# EAGLE design M32.v1.0 (EAGLE 6.1)

## Sheet 1 of 3
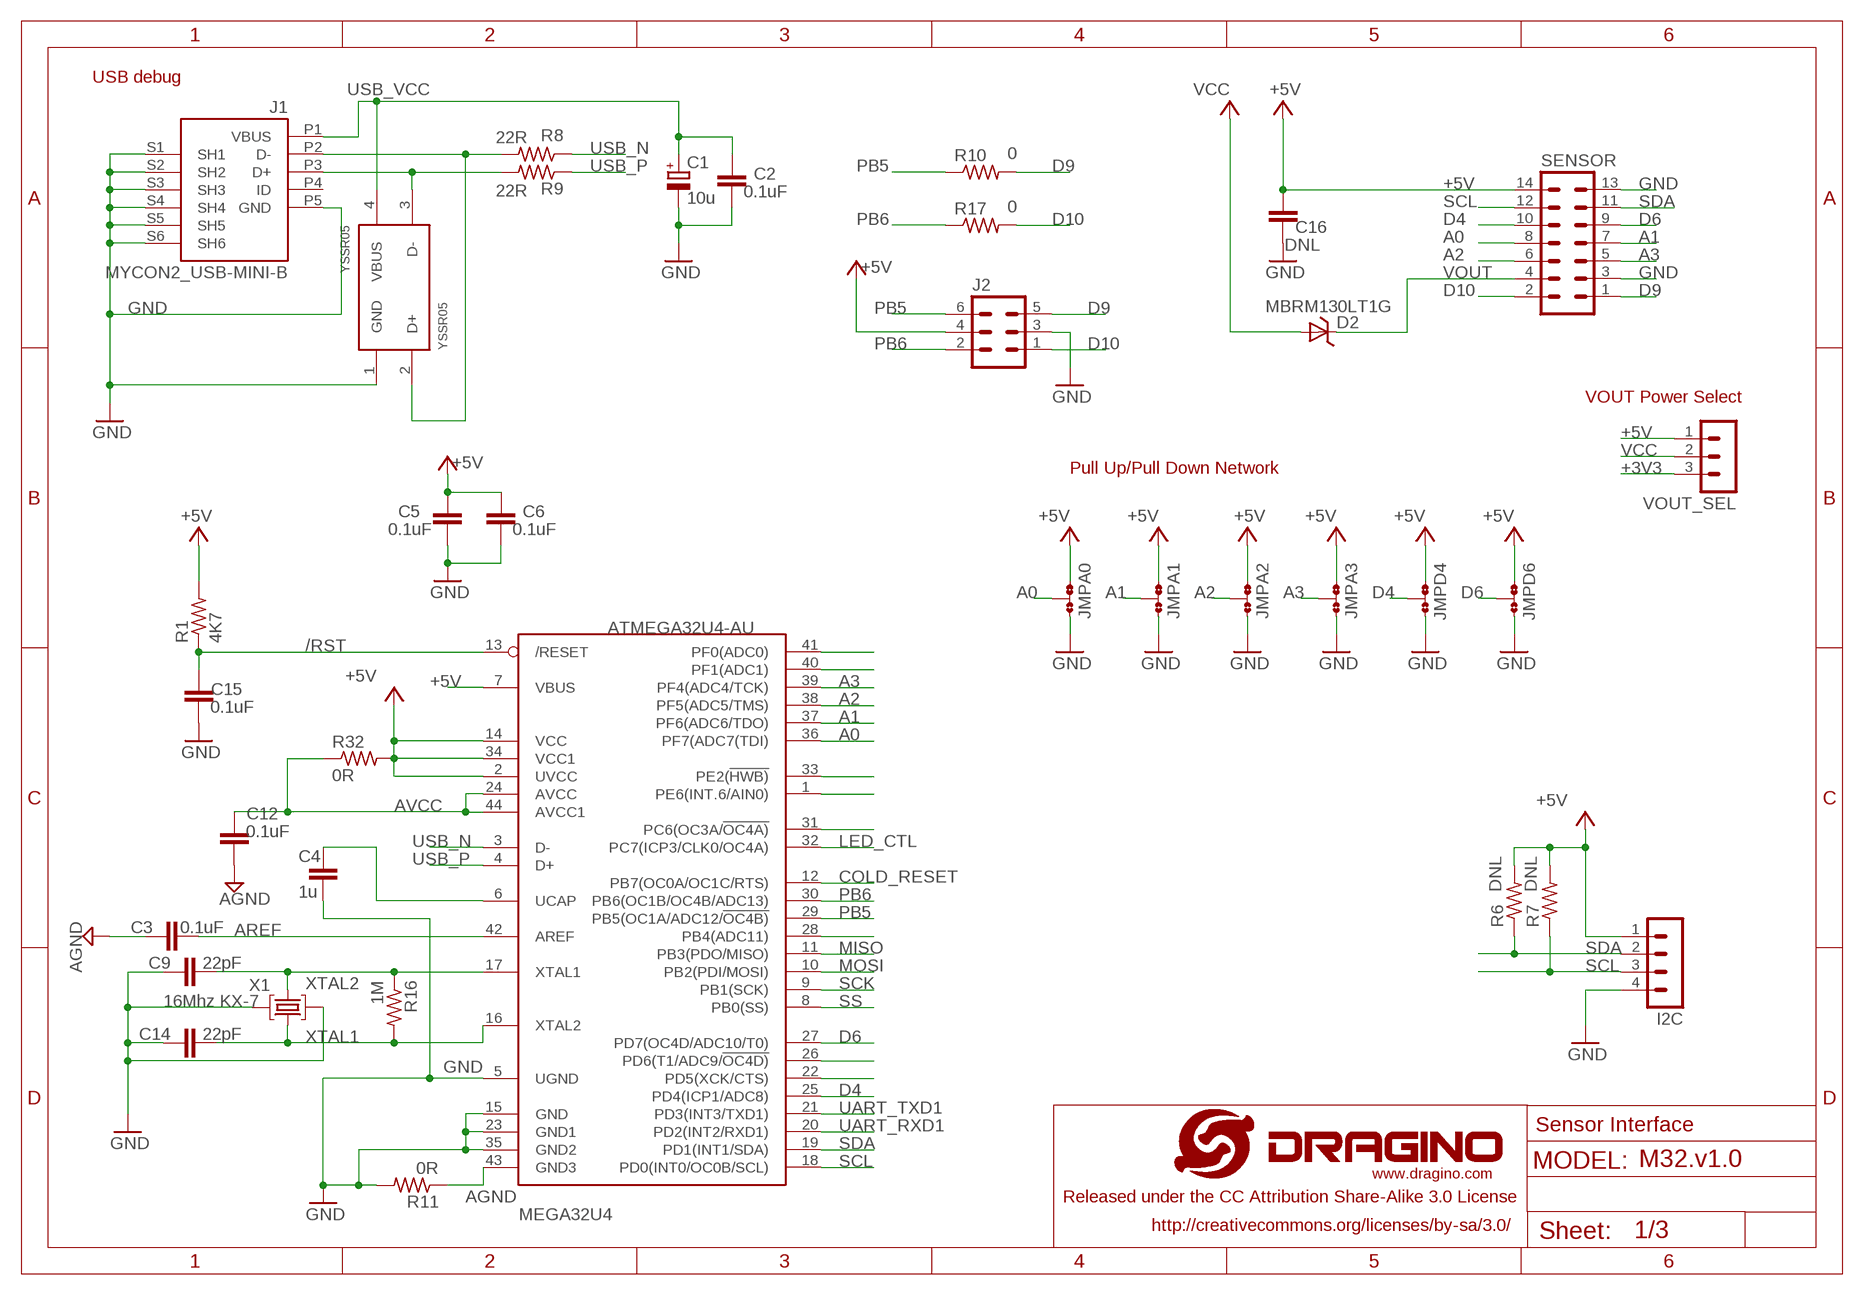
[diagram p0: schematic, sheet 1]

### Parts
C1  10u  CPOL-EUSMCB  [SMC_B]
C2  0.1uF  C-EUC0402  [C0402]
C3  0.1uF  C-EUC0402  [C0402]
C4  1u  C-EUC0402  [C0402]
C5  0.1uF  C-EUC0402  [C0402]
C6  0.1uF  C-EUC0402  [C0402]
C9  22pF  C-EUC0402  [C0402]
C12  0.1uF  C-EUC0402  [C0402]
C14  22pF  C-EUC0402  [C0402]
C15  0.1uF  C-EUC0402  [C0402]
C16  DNL  C-EUC0402  [C0402]
D2  MBRM130LT1G  [POWERMITE]
I2C  MA04-1  [MA04-1]
J1  MYCON2_USB-MINI-B  [CON2_USB_MICRO_B_AT]
J2  MA03-2  [MA03-2]
JMPA0  JUM-A2  0R-JUMPA  [A0R-JMP]
JMPA1  JUM-A2  0R-JUMPA  [A0R-JMP]
JMPA2  JUM-A2  0R-JUMPA  [A0R-JMP]
JMPA3  JUM-A2  0R-JUMPA  [A0R-JMP]
JMPD4  JUM-A2  0R-JUMPA  [A0R-JMP]
JMPD6  JUM-A2  0R-JUMPA  [A0R-JMP]
MEGA32U4  ATMEGA32U4-AU  [TQFP44]
R1  4K7  R-US_R0402  [R0402]
R6  DNL  R-US_R0603  [R0603]
R7  DNL  R-US_R0603  [R0603]
R8  22R  R-US_R0402  [R0402]
R9  22R  R-US_R0402  [R0402]
R10  0  R-US_R0603  [R0603]
R11  0R  R-US_R0603  [R0603]
R16  1M  R-US_R0402  [R0402]
R17  0  R-US_R0603  [R0603]
R32  0R  R-US_R0402  [R0402]
SENSOR  MA07-2  [MA07-2]
VOUT_SEL  MA03-1  [MA03-1]
X1  16Mhz KX-7  CRYSTAL-3.2-2.5  [CRYSTAL-3.2-2.5]
YSSR05  YSSR05  [SOT143]

### Nets
32U4_A4: MEGA32U4.40(PF1(ADC1)) ; also sheet 3
32U4_A5: MEGA32U4.41(PF0(ADC0)) ; also sheet 3
+3V3: VOUT_SEL.3 ; also sheet 2
+5V: C5.1 C6.1 C16.1 I2C.1 J2.4 JMPA0.3 JMPA1.3 JMPA2.3 JMPA3.3 JMPD4.3 JMPD6.3 MEGA32U4.2(UVCC) MEGA32U4.7(VBUS) MEGA32U4.14(VCC) MEGA32U4.34(VCC1) R1.2 R6.2 R7.2 R32.2 SENSOR.14 VOUT_SEL.1 ; also sheet 2,3
/RST: C15.1 MEGA32U4.13(/RESET) R1.1 ; also sheet 2,3
A0: JMPA0.2 MEGA32U4.36(PF7(ADC7(TDI)) SENSOR.8 ; also sheet 3
A1: JMPA1.2 MEGA32U4.37(PF6(ADC6/TDO)) SENSOR.7 ; also sheet 3
A2: JMPA2.2 MEGA32U4.38(PF5(ADC5/TMS)) SENSOR.6 ; also sheet 3
A3: JMPA3.2 MEGA32U4.39(PF4(ADC4/TCK)) SENSOR.5 ; also sheet 3
AGND: C3.1 MEGA32U4.43(GND3) R11.1 ; also sheet 3
AREF: C3.2 MEGA32U4.42(AREF) ; also sheet 3
AVCC: C12.1 MEGA32U4.24(AVCC) MEGA32U4.44(AVCC1) R32.1 ; also sheet 3
COLD_RESET: MEGA32U4.12(PB7(OC0A/OC1C/RTS)) ; also sheet 2,3
D4: JMPD4.2 MEGA32U4.25(PD4(ICP1/ADC8)) SENSOR.10 ; also sheet 3
D6: JMPD6.2 MEGA32U4.27(PD7(OC4D/ADC10/T0)) SENSOR.9 ; also sheet 3
D9: J2.5 R10.2 SENSOR.1
D10: J2.1 R17.2 SENSOR.2
GND [gnd]: C1.- C2.2 C4.1 C5.2 C6.2 C9.1 C14.1 C15.2 C16.2 I2C.4 J1.P5(GND) J1.S1(SH1) J1.S2(SH2) J1.S3(SH3) J1.S4(SH4) J1.S5(SH5) J1.S6(SH6) J2.3 JMPA0.1 JMPA1.1 JMPA2.1 JMPA3.1 JMPD4.1 JMPD6.1 MEGA32U4.5(UGND) MEGA32U4.15(GND) MEGA32U4.23(GND1) MEGA32U4.35(GND2) R11.2 SENSOR.3 SENSOR.13 X1.2(GND) X1.4(GND) YSSR05.1(GND) ; also sheet 2,3
GND1: C12.2 ; supply symbol labelled AGND
LED_CTL: MEGA32U4.32(PC7(ICP3/CLK0/OC4A)) ; also sheet 2,3
MISO: MEGA32U4.11(PB3(PDO/MISO)) ; also sheet 2,3
MOSI: MEGA32U4.10(PB2(PDI/MOSI)) ; also sheet 2,3
N$2: J1.P2(D-) R8.2 YSSR05.2(D+)
N$4: C4.2 MEGA32U4.6(UCAP) ; also sheet 3
N$10: J1.P3(D+) R9.2 YSSR05.3(D-)
PB4: MEGA32U4.28(PB4(ADC11)) ; also sheet 3
PB5: J2.6 MEGA32U4.29(PB5(OC1A/ADC12/!OC4B)) R10.1 ; also sheet 3
PB6: J2.2 MEGA32U4.30(PB6(OC1B/OC4B/ADC13)) R17.1 ; also sheet 3
PC6: MEGA32U4.31(PC6(OC3A/!OC4A)) ; also sheet 3
PD5: MEGA32U4.22(PD5(XCK/CTS)) ; also sheet 3
PD6: MEGA32U4.26(PD6(T1/ADC9/!OC4D)) ; also sheet 3
PE2: MEGA32U4.33(PE2(!HWB)) ; also sheet 3
PE6: MEGA32U4.1(PE6(INT.6/AIN0)) ; also sheet 3
SCK: MEGA32U4.9(PB1(SCK)) ; also sheet 2,3
SCL: I2C.3 MEGA32U4.18(PD0(INT0/OC0B/SCL)) R7.1 SENSOR.12 ; also sheet 3
SDA: I2C.2 MEGA32U4.19(PD1(INT1/SDA)) R6.1 SENSOR.11 ; also sheet 3
SS: MEGA32U4.8(PB0(SS)) ; also sheet 2,3
UART_RXD1: MEGA32U4.20(PD2(INT2/RXD1)) ; also sheet 2,3
UART_TXD1: MEGA32U4.21(PD3(INT3/TXD1)) ; also sheet 2,3
USB_N: MEGA32U4.3(D-) R8.1 ; also sheet 3
USB_P: MEGA32U4.4(D+) R9.1 ; also sheet 3
USB_VCC: C1.+ C2.1 J1.P1(VBUS) YSSR05.4(VBUS)
VCC: D2.2(A) VOUT_SEL.2
VOUT: D2.1(C) SENSOR.4
XTAL1: C14.2 MEGA32U4.16(XTAL2) R16.2 X1.3(C2) ; also sheet 3
XTAL2: C9.2 MEGA32U4.17(XTAL1) R16.1 X1.1(C1) ; also sheet 3
Unconnected: J1.P4(ID)

### Notes on the sheet
- USB debug
- VOUT Power Select
- Pull Up/Pull Down Network
- Sensor Interface

## Sheet 2 of 3
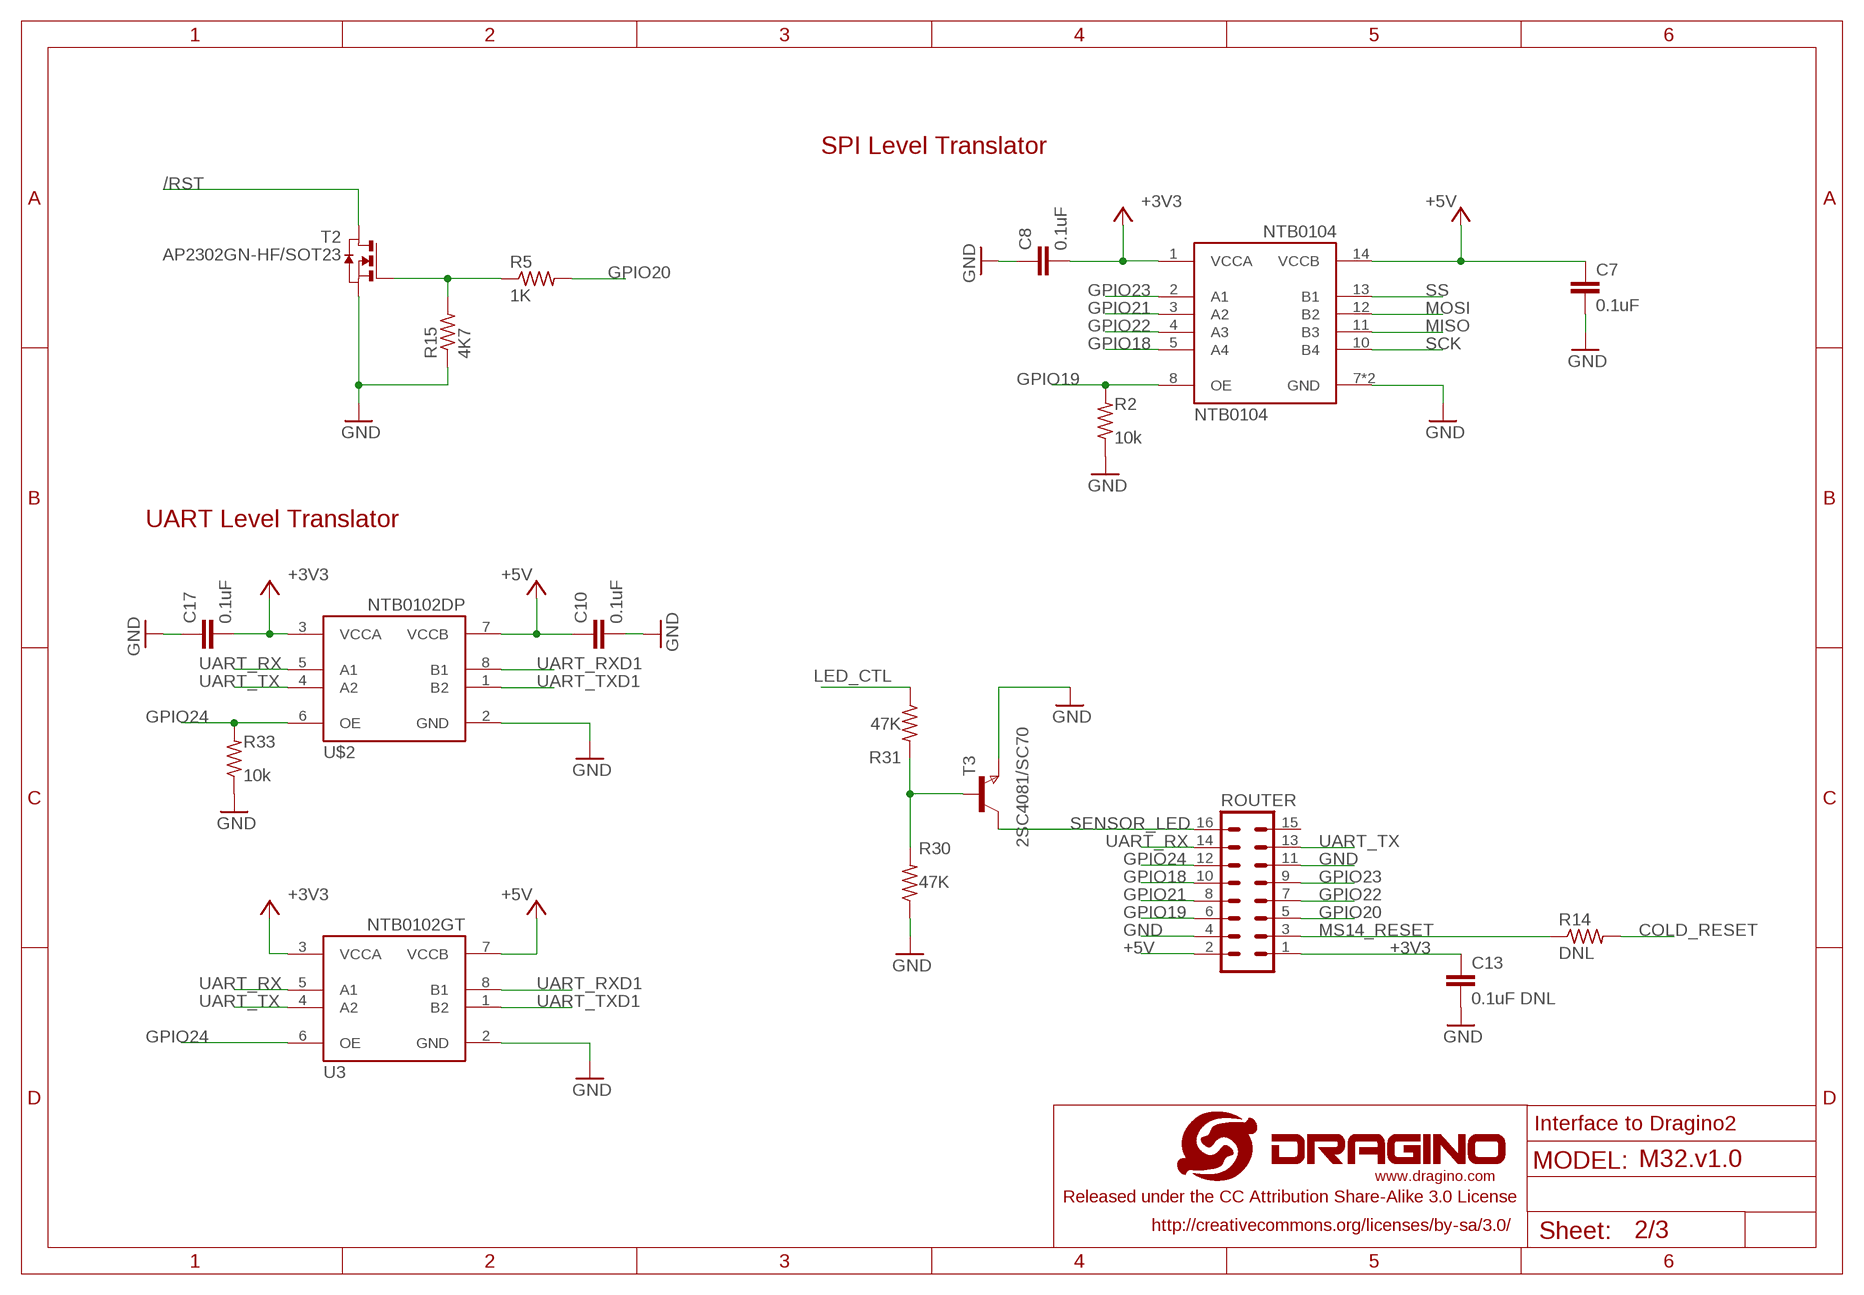
[diagram p1: schematic, sheet 2]

### Parts
C7  0.1uF  C-EUC0402  [C0402]
C8  0.1uF  C-EUC0402  [C0402]
C10  0.1uF  C-EUC0402  [C0402]
C13  0.1uF DNL  C-EUC0402  [C0402]
C17  0.1uF  C-EUC0402  [C0402]
NTB0104  NTB0104  [DHVQFN14]
R2  10k  R-US_R0402  [R0402]
R5  1K  R-US_R0402  [R0402]
R14  DNL  R-US_R0402  [R0402]
R15  4K7  R-US_R0402  [R0402]
R30  47K  R-US_R0402  [R0402]
R31  47K  R-US_R0402  [R0402]
R33  10k  R-US_R0402  [R0402]
ROUTER  MA08-2  [MA08-2]
T2  AP2302GN-HF/SOT23  NMOSFET-SOT23  [SOT-23]
T3  2SC4081/SC70  NPNSOT323  [SOT323]
U3  NTB0102GT  [NXP-SOT833-1]
U$2  NTB0102DP  [NTB0102-SOT505-2]
U$5  LOGO-NEW  [LOGO-SILK-NEW]

### Nets
+3V3: C8.2 C13.1 C17.2 NTB0104.1(VCCA) ROUTER.1 U3.3(VCCA) U$2.3(VCCA) ; also sheet 1
+5V: C7.1 C10.1 NTB0104.14(VCCB) ROUTER.2 U3.7(VCCB) U$2.7(VCCB) ; also sheet 1,3
/RST: T2.1(D) ; also sheet 1,3
COLD_RESET: R14.2 ; also sheet 1,3
GND [gnd]: C7.2 C8.1 C10.2 C13.2 C17.1 NTB0104.7(GND) NTB0104.EXP(GND) R2.1 R15.1 R30.1 R33.1 ROUTER.4 ROUTER.11 T2.2(S) T3.3(E) U3.2(GND) U$2.2(GND) ; also sheet 1,3
GPIO18: NTB0104.5(A4) ROUTER.10
GPIO19: NTB0104.8(OE) R2.2 ROUTER.6
GPIO20: R5.2 ROUTER.5
GPIO21: NTB0104.3(A2) ROUTER.8
GPIO22: NTB0104.4(A3) ROUTER.7
GPIO23: NTB0104.2(A1) ROUTER.9
GPIO24: R33.2 ROUTER.12 U3.6(OE) U$2.6(OE)
LED_CTL: R31.1 ; also sheet 1,3
MISO: NTB0104.11(B3) ; also sheet 1,3
MOSI: NTB0104.12(B2) ; also sheet 1,3
MS14_RESET: R14.1 ROUTER.3
N$8: R5.1 R15.2 T2.3(G)
N$9: R30.2 R31.2 T3.2(B)
SCK: NTB0104.10(B4) ; also sheet 1,3
SENSOR_LED: ROUTER.16 T3.1(C)
SS: NTB0104.13(B1) ; also sheet 1,3
UART_RX: ROUTER.14 U3.5(A1) U$2.5(A1)
UART_RXD1: U3.8(B1) U$2.8(B1) ; also sheet 1,3
UART_TX: ROUTER.13 U3.4(A2) U$2.4(A2)
UART_TXD1: U3.1(B2) U$2.1(B2) ; also sheet 1,3
Unconnected: ROUTER.15

### Notes on the sheet
- SPI Level Translator
- UART Level Translator
- Interface to Dragino2

## Sheet 3 of 3
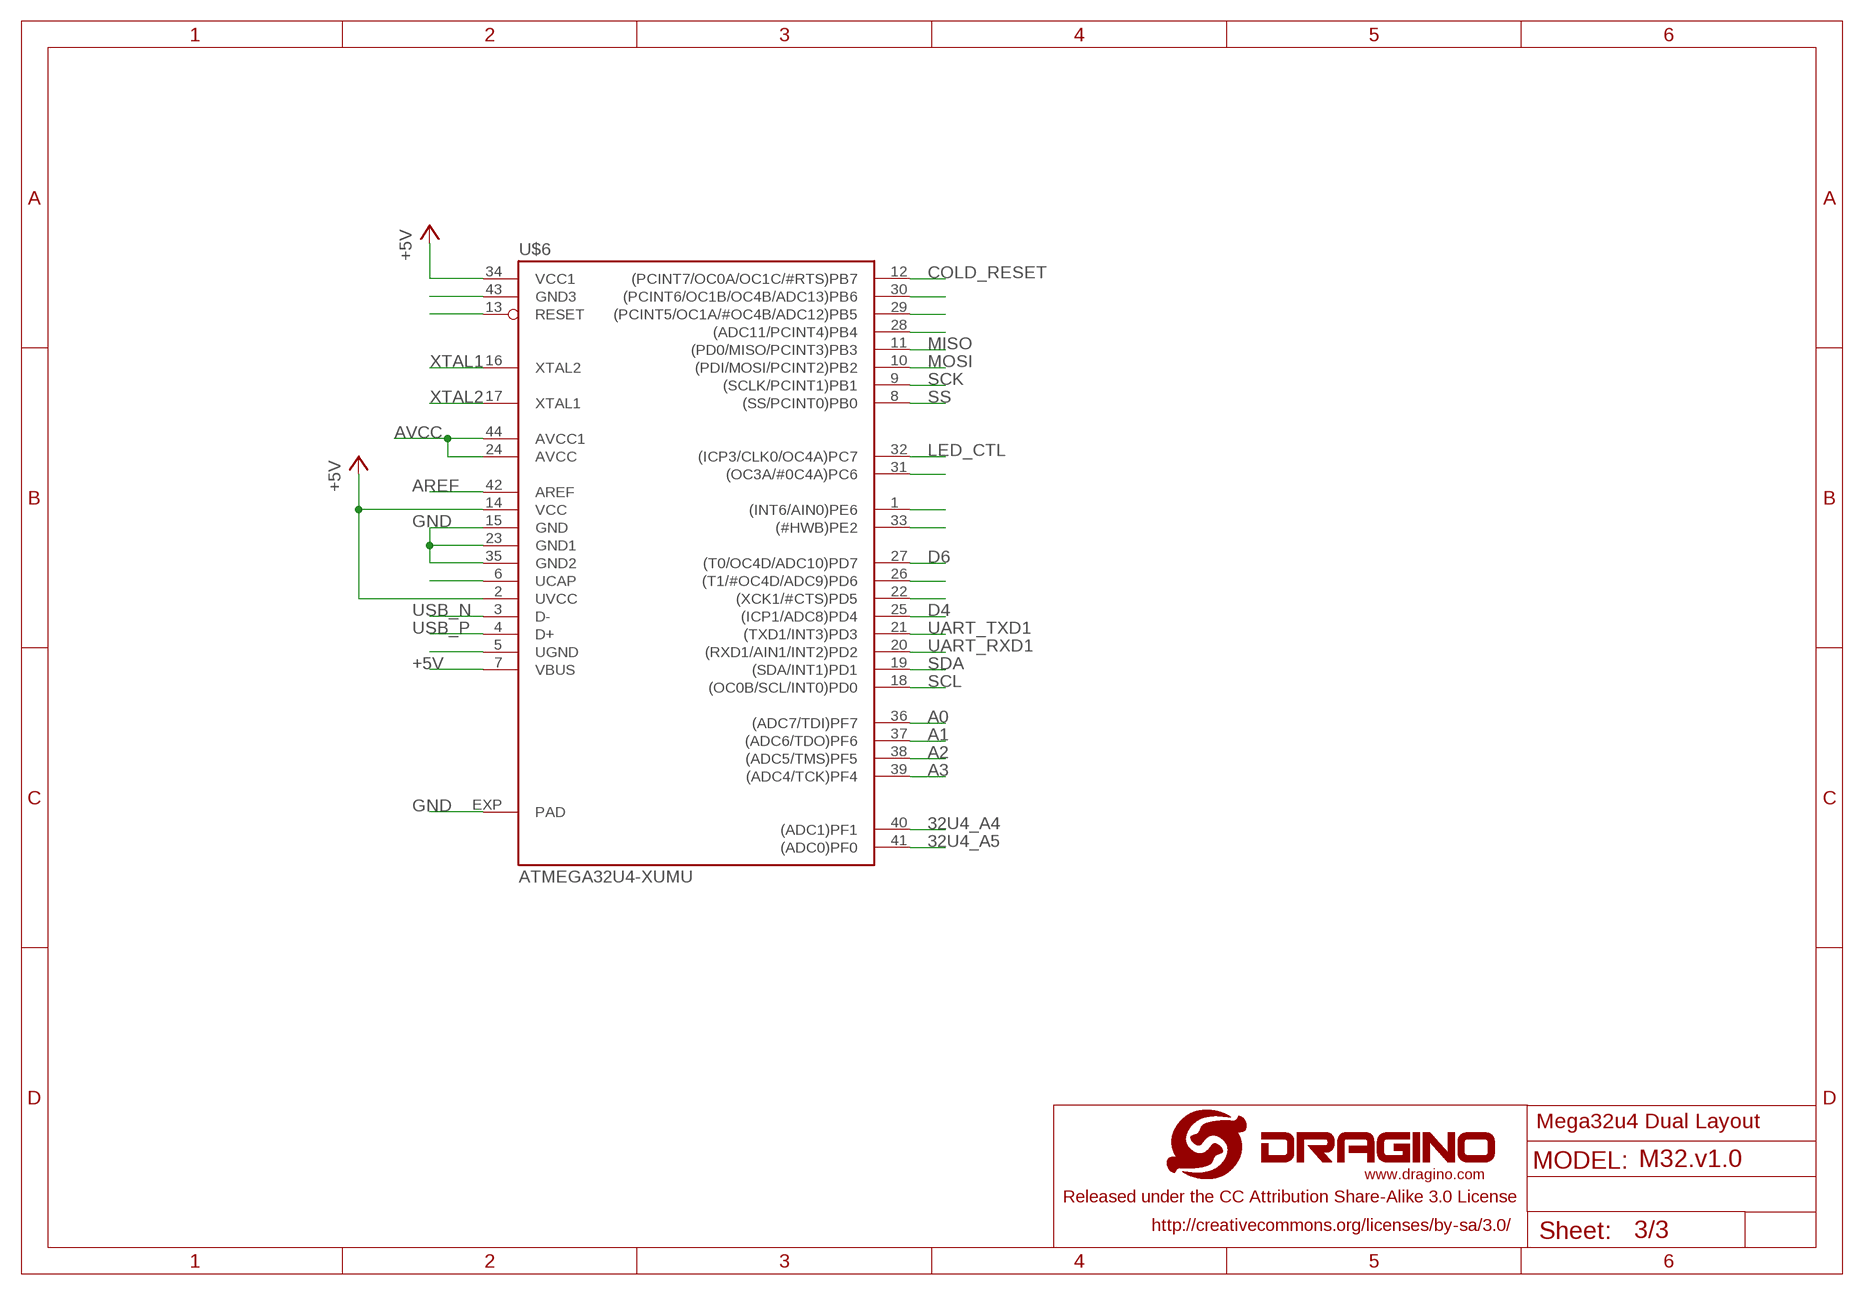
[diagram p2: schematic, sheet 3]

### Parts
U$6  ATMEGA32U4-XUMU  [QFN44ML7X7]

### Nets
32U4_A4: U$6.40((ADC1)PF1) ; also sheet 1
32U4_A5: U$6.41((ADC0)PF0) ; also sheet 1
+5V: U$6.2(UVCC) U$6.7(VBUS) U$6.14(VCC) U$6.34(VCC1) ; also sheet 1,2
/RST: U$6.13(RESET) ; also sheet 1,2
A0: U$6.36((ADC7/TDI)PF7) ; also sheet 1
A1: U$6.37((ADC6/TDO)PF6) ; also sheet 1
A2: U$6.38((ADC5/TMS)PF5) ; also sheet 1
A3: U$6.39((ADC4/TCK)PF4) ; also sheet 1
AGND: U$6.43(GND3) ; also sheet 1
AREF: U$6.42(AREF) ; also sheet 1
AVCC: U$6.24(AVCC) U$6.44(AVCC1) ; also sheet 1
COLD_RESET: U$6.12((PCINT7/OC0A/OC1C/#RTS)PB7) ; also sheet 1,2
D4: U$6.25((ICP1/ADC8)PD4) ; also sheet 1
D6: U$6.27((T0/OC4D/ADC10)PD7) ; also sheet 1
GND [gnd]: U$6.5(UGND) U$6.15(GND) U$6.23(GND1) U$6.35(GND2) U$6.EXP(PAD) ; also sheet 1,2
LED_CTL: U$6.32((ICP3/CLK0/OC4A)PC7) ; also sheet 1,2
MISO: U$6.11((PD0/MISO/PCINT3)PB3) ; also sheet 1,2
MOSI: U$6.10((PDI/MOSI/PCINT2)PB2) ; also sheet 1,2
N$4: U$6.6(UCAP) ; also sheet 1
PB4: U$6.28((ADC11/PCINT4)PB4) ; also sheet 1
PB5: U$6.29((PCINT5/OC1A/#OC4B/ADC12)PB5) ; also sheet 1
PB6: U$6.30((PCINT6/OC1B/OC4B/ADC13)PB6) ; also sheet 1
PC6: U$6.31((OC3A/#0C4A)PC6) ; also sheet 1
PD5: U$6.22((XCK1/#CTS)PD5) ; also sheet 1
PD6: U$6.26((T1/#OC4D/ADC9)PD6) ; also sheet 1
PE2: U$6.33((#HWB)PE2) ; also sheet 1
PE6: U$6.1((INT6/AIN0)PE6) ; also sheet 1
SCK: U$6.9((SCLK/PCINT1)PB1) ; also sheet 1,2
SCL: U$6.18((OC0B/SCL/INT0)PD0) ; also sheet 1
SDA: U$6.19((SDA/INT1)PD1) ; also sheet 1
SS: U$6.8((SS/PCINT0)PB0) ; also sheet 1,2
UART_RXD1: U$6.20((RXD1/AIN1/INT2)PD2) ; also sheet 1,2
UART_TXD1: U$6.21((TXD1/INT3)PD3) ; also sheet 1,2
USB_N: U$6.3(D-) ; also sheet 1
USB_P: U$6.4(D+) ; also sheet 1
XTAL1: U$6.16(XTAL2) ; also sheet 1
XTAL2: U$6.17(XTAL1) ; also sheet 1

### Notes on the sheet
- Mega32u4 Dual Layout

## Library data of the parts
C1 = rcl:CPOL-EU: POLARIZED CAPACITOR, European symbol
C2-C10 C12-C17 = SmartPrj:C-EU: CAPACITOR, European symbol
D2 = dragino:MBRM130LT1G: Schottky Power Rectifier http://www.onsemi.cn/pub_link/Collateral/MBRM130L-D.PDF
I2C = con-lstb:MA04-1: PIN HEADER; OC_FARNELL: unknown; OC_NEWARK: unknown
J1 = SmartPrj:MYCON2_USB-MINI-B
J2 = con-lstb:MA03-2: PIN HEADER; OC_FARNELL: unknown; OC_NEWARK: unknown
JMPA0 JMPA1-JMPA3 JMPD4 JMPD6 = jump-0r-smd:0R-JUMP: SMD 0R 0805 Jumper
MEGA32U4 = adafruit:ATMEGA32U4: http://www.ladyada.net/library/eagle
NTB0104 = dragino:NTB0104
R1 R2 R5 R8 R9 R11 R14-R16 R30 R31 R33 = dragino:R-US_: RESISTOR, American symbol
R6 R7 R10 R17 R32 = rcl:R-US_: RESISTOR, American symbol
ROUTER = dragino:MA08-2: PIN HEADER; OC_FARNELL: unknown; OC_NEWARK: unknown
SENSOR = dragino:MA07-2: PIN HEADER; OC_FARNELL: unknown; OC_NEWARK: unknown
T2 = dragino:NMOSFET-SOT23: MOS FET; OC_FARNELL: unknown; OC_NEWARK: unknown
T3 = zetex:NPNSOT323: NPN TRANSISTOR; MPN: DSS4160U-7; OC_FARNELL: 1710696; OC_NEWARK: 25R4558
U3 U$2 = dragino:NTB0102
U$5 = dragino:LOGO-NEW
U$6 = dragino:ATMEGA32U4-XU
VOUT_SEL = con-lstb:MA03-1: PIN HEADER; OC_FARNELL: unknown; OC_NEWARK: unknown
X1 = SmartPrj:CRYSTAL-3.2-2.5
YSSR05 = dragino:YSSR05: Yeashin LOW CAPACITANCE TVS DIODE ARRAY http://www.yeashin.tw/download.php?id=4588

## Net classes
0 default: width 0.203 mm, clearance 0.254 mm
1 power: width 0.61 mm, drill 0.61 mm, clearance 0.254 mm
2 gnd: width 0.305 mm, drill 0.33 mm, clearance 0.254 mm
3 usbvcc: width 0.508 mm, drill 0.61 mm, clearance 0.254 mm
4 aref: width 0.406 mm, drill 0.61 mm, clearance 0.254 mm

## Board
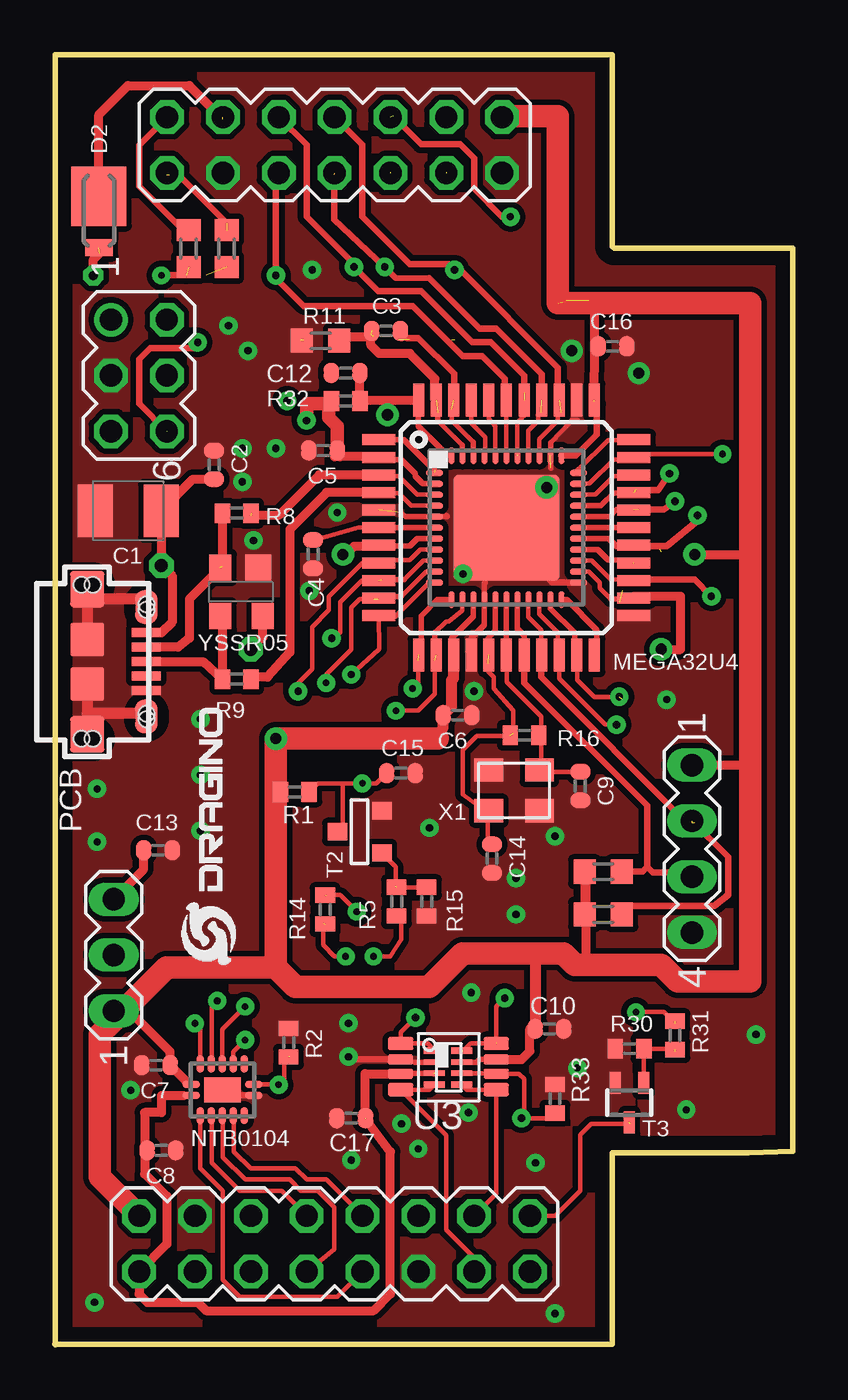
[diagram p3: board, top side]
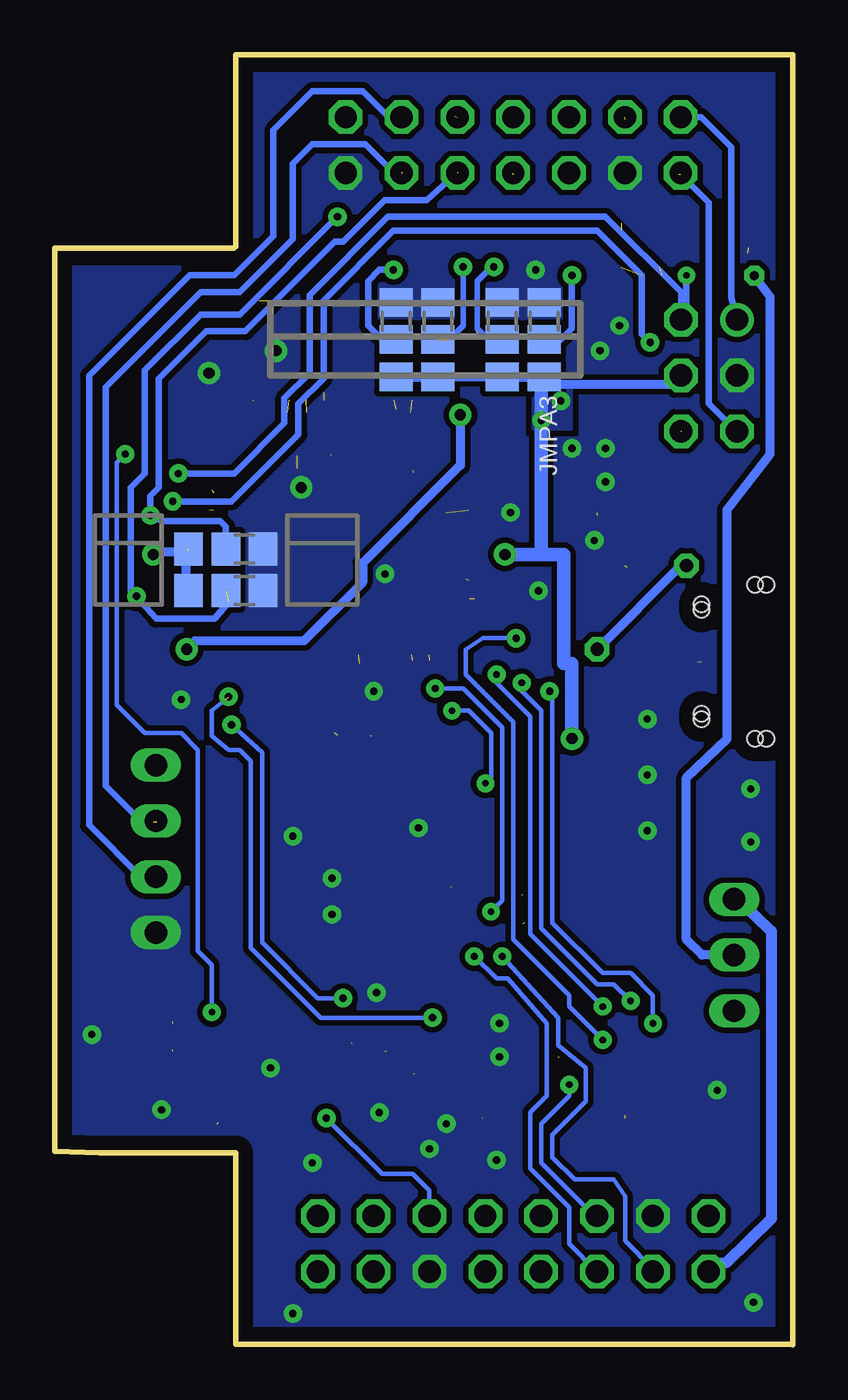
[diagram p4: board, bottom side, seen from below]

Size 33.57 x 58.69 mm. Coordinates in mm from the lower left corner, seen from the top.
Outline: 25.35,49.96 25.35,58.69 0.02,58.69 0.02,0
Outline: 25.45,49.9 33.57,49.9 33.57,8.8 31.53,8.73 25.35,8.73 25.35,0.02 0,0.02
Copper layers (1*16): Top 0.035mm / dielectric 1.5mm / Bottom 0.035mm
Design rules: minimum track width 5mil, minimum drill 10mil, track to track 6mil, track to pad 7mil, pad to pad 7mil, via to via 10mil, smd to smd 7mil, copper to edge 26mil, drill to drill 10mil, minimum pad ring 10mil, minimum via ring 10mil, stop-mask expansion 1mil, vias tented up to drill 30mil, thermal gap 10mil

### Footprints (pad centres in the part's own frame; a part is rotated, then mirrored left to right if it is on the bottom)
SMC_B = smd 1.6 x 2.4: + -1.5,0; - 1.5,0
C0402 = smd 0.7 x 0.9: 1 -0.65,0; 2 0.65,0
POWERMITE = smd 2.7 x 2.5: 1 -0.635,0 | smd 0.76 x 1.27: 2 1.695,0
MA04-1 = drill 1.016 long: 1 -3.81,0; 2 -1.27,0; 3 1.27,0; 4 3.81,0
CON2_USB_MICRO_B_AT = smd 0.406 x 1.346: P1 -1.321,2.692; P2 -0.66,2.692; P3 0,2.692; P4 0.66,2.692; P5 1.321,2.692 | smd 1.651 x 1.549: S1 -3.302,0; S2 3.302,0 | smd 1.524 x 1.016: S3 -2.489,2.692; S4 2.489,2.692 | smd 1.524 x 1.524: S5 -1.016,0; S6 1.016,0 | hole 0.7: -3.505,0.254; -3.505,-0.254; 3.505,0.254; 3.505,-0.254; -2.616,2.692; -2.362,2.692; 2.362,2.692; 2.616,2.692
MA03-2 = drill 1.016: 1 -2.54,-1.27 | drill 1.016 octagon: 2 -2.54,1.27; 3 0,-1.27; 4 0,1.27; 5 2.54,-1.27; 6 2.54,1.27
A0R-JMP = smd 1.5 x 1.3: 1 0,1.7; 2 0,0; 3 0,-1.7
TQFP44 = smd 1.5 x 0.5: 1 -5.8,4; 2 -5.8,3.2; 3 -5.8,2.4; 4 -5.8,1.6; 5 -5.8,0.8; 6 -5.8,0; 7 -5.8,-0.8; 8 -5.8,-1.6; 9 -5.8,-2.4; 10 -5.8,-3.2; 11 -5.8,-4; 23 5.8,-4; 24 5.8,-3.2; 25 5.8,-2.4; 26 5.8,-1.6; 27 5.8,-0.8; 28 5.8,0; 29 5.8,0.8; 30 5.8,1.6; 31 5.8,2.4; 32 5.8,3.2; 33 5.8,4 | smd 0.5 x 1.5: 12 -4,-5.8; 13 -3.2,-5.8; 14 -2.4,-5.8; 15 -1.6,-5.8; 16 -0.8,-5.8; 17 0,-5.8; 18 0.8,-5.8; 19 1.6,-5.8; 20 2.4,-5.8; 21 3.2,-5.8; 22 4,-5.8; 34 4,5.8; 35 3.2,5.8; 36 2.4,5.8; 37 1.6,5.8; 38 0.8,5.8; 39 0,5.8; 40 -0.8,5.8; 41 -1.6,5.8; 42 -2.4,5.8; 43 -3.2,5.8; 44 -4,5.8
DHVQFN14 = smd 0.8 x 0.35: 1 -1.425,-0.25; 7 1.425,-0.25; 8 1.425,0.25; 14 -1.425,0.25 | smd 0.35 x 0.8: 2 -1,-1.175; 3 -0.5,-1.175; 4 0,-1.175; 5 0.5,-1.175; 6 1,-1.175; 9 1,1.175; 10 0.5,1.175; 11 0,1.175; 12 -0.5,1.175; 13 -1,1.175 | smd 1.65 x 1.15: EXP 0,0
R0402 = smd 0.7 x 0.9: 1 -0.65,0; 2 0.65,0
R0603 = smd 1 x 1.1: 1 -0.85,0; 2 0.85,0
MA08-2 = drill 1.016 octagon: 1 -8.89,-1.27; 2 -8.89,1.27; 3 -6.35,-1.27; 4 -6.35,1.27; 5 -3.81,-1.27; 6 -3.81,1.27; 7 -1.27,-1.27; 8 -1.27,1.27; 9 1.27,-1.27; 10 1.27,1.27; 11 3.81,-1.27; 12 3.81,1.27; 13 6.35,-1.27; 14 6.35,1.27; 15 8.89,-1.27; 16 8.89,1.27
MA07-2 = drill 1.016 octagon: 1 -7.62,-1.27; 2 -7.62,1.27; 3 -5.08,-1.27; 4 -5.08,1.27; 5 -2.54,-1.27; 6 -2.54,1.27; 7 0,-1.27; 8 0,1.27; 9 2.54,-1.27; 10 2.54,1.27; 11 5.08,-1.27; 12 5.08,1.27; 13 7.62,-1.27; 14 7.62,1.27
SOT-23 = smd 0.787 x 0.889: 1 0.025,-1.016; 2 -0.94,1.016; 3 0.991,1.016
SOT323 = smd 0.5 x 1: 1 0,0.9; 2 -0.65,-0.9; 3 0.65,-0.9
NXP-SOT833-1 = smd 1 x 0.3: 1 -0.614,0.778 | smd 0.95 x 0.25: 2 -0.639,0.253; 3 -0.639,-0.247; 6 0.611,-0.247; 7 0.611,0.253 | smd 0.95 x 0.3: 4 -0.639,-0.772; 5 0.611,-0.772; 8 0.611,0.778
NTB0102-SOT505-2 = smd 1.15 x 0.6: 1 -2.318,1.084; 4 -2.318,-1.016; 5 2.032,-1.016; 8 2.032,1.084 | smd 1.15 x 0.45: 2 -2.318,0.359; 3 -2.318,-0.291; 6 2.032,-0.291; 7 2.032,0.359
QFN44ML7X7 = smd 0.75 x 0.275: 1 -3.275,2.5; 2 -3.275,2; 3 -3.275,1.5; 4 -3.275,1; 5 -3.275,0.5; 6 -3.275,0; 7 -3.275,-0.5; 8 -3.275,-1; 9 -3.275,-1.5; 10 -3.275,-2; 11 -3.275,-2.5; 23 3.275,-2.5; 24 3.275,-2; 25 3.275,-1.5; 26 3.275,-1; 27 3.275,-0.5; 28 3.275,0; 29 3.275,0.5; 30 3.275,1; 31 3.275,1.5; 32 3.275,2; 33 3.275,2.5 | smd 0.275 x 0.75: 12 -2.5,-3.275; 13 -2,-3.275; 14 -1.5,-3.275; 15 -1,-3.275; 16 -0.5,-3.275; 17 0,-3.275; 18 0.5,-3.275; 19 1,-3.275; 20 1.5,-3.275; 21 2,-3.275; 22 2.5,-3.275; 34 2.5,3.275; 35 2,3.275; 36 1.5,3.275; 37 1,3.275; 38 0.5,3.275; 39 0,3.275; 40 -0.5,3.275; 41 -1,3.275; 42 -1.5,3.275; 43 -2,3.275; 44 -2.5,3.275 | smd 4.826 x 4.826: EXP 0,0
MA03-1 = drill 1.016 long: 1 -2.54,0; 2 0,0; 3 2.54,0
CRYSTAL-3.2-2.5 = smd 1.3 x 1.05: 1 -1.15,-0.925; 2 1.15,-0.925; 3 1.15,0.925; 4 -1.15,0.925
SOT143 = smd 1.194 x 1.194: 1 -0.72,-1.143 | smd 0.991 x 1.194: 2 1.007,-1.143; 3 1.007,1.067; 4 -0.923,1.067

### Placement (x,y rotation side)
C1  3.33,37.94 180 top
C2  7.24,40.03 90 top
C3  15.06,46.13 0 top
C4  11.75,35.97 90 top
C5  12.2,40.69 180 top
C6  18.31,28.64 0 top
C7  4.59,12.72 180 top
C8  4.84,8.84 180 top
C9  23.9,25.42 90 top
C10  22.49,14.37 0 top
C12  13.22,44.21 180 top
C13  4.69,22.5 0 top
C14  19.88,22.12 90 top
C15  15.74,26.01 0 top
C16  25.37,45.43 0 top
C17  13.48,10.3 0 top
D2  2,51.62 270 top
I2C  28.98,22.56 270 top
J1  1.47,31.08 270 top
J2  3.82,44.1 270 top
JMPA0  18.05,45.74 0 bottom
JMPA1  16.15,45.74 0 bottom
JMPA2  13.22,45.74 0 bottom
JMPA3  11.32,45.74 0 bottom
JMPD4  25.8,34.31 270 bottom
JMPD6  25.8,36.21 270 bottom
MEGA32U4  20.54,37.18 0 top
NTB0104  7.62,11.6 0 top
R1  10.91,25.15 180 top
R2  10.63,13.74 270 top
R5  15.54,20.16 270 top
R6  24.94,19.58 180 top
R7  24.94,21.52 180 top
R8  8.27,37.83 180 top
R9  8.27,30.28 180 top
R10  7.81,49.87 90 top
R11  12.09,45.68 180 top
R14  12.29,19.8 90 top
R15  16.91,20.16 90 top
R16  21.36,27.73 180 top
R17  6.08,49.87 90 top
R30  26.14,13.46 0 top
R31  28.21,14.07 270 top
R32  13.22,42.94 180 top
R33  22.75,11.19 270 top
ROUTER  12.72,4.59 0 top
SENSOR  12.72,54.59 0 top
T2  13.86,23.36 270 top
T3  26.13,11.01 180 top
U3  17.89,12.6 0 top
U$2  18.04,12.62 0 top
U$5  8.22,17.27 90 top
U$6  20.54,37.18 0 top
VOUT_SEL  2.67,17.72 90 top
X1  20.88,25.22 180 top
YSSR05  8.53,34.22 180 top

### Tracks (layer width: path | path; a pad name or v marks a point on that pad's centre or on a via)
32U4_A4
  Top 0.203: MEGA32U4.40 19.74,42.14 20.03,41.8 20.03,40.49 U$6.40
32U4_A5
  Top 0.203: MEGA32U4.41 18.94,41.93 19.57,41.29 19.57,40.49 U$6.41
+3V3  (2 unrouted)
  Top 0.203: C8.2 4.14,8.84 4.08,8.78
  Top 0.254: 17.23,12.33 17.23,12.34 16.02,12.34
  Top 0.305: 5.86,11.32 5.88,11.35 NTB0104.1 | 16.02,12.34 U$2.3
  Top 0.406: VOUT_SEL.3 4.04,21.63 C13.1 | U$2.3 14.11,12.33 14.11,10.3 15.26,8.78 15.26,2.3 14.49,1.54 6.87,1.54 6.49,1.92 4.21,1.92 3.83,2.29 ROUTER.1 5.1,4.58 5.1,6.75 4.08,7.76 4.08,8.78 4.08,10.56 4.84,10.56 4.84,11.32 5.86,11.32
  Bottom 0.508: VOUT_SEL.3 2.48,20.26 0.98,18.81 0.98,5.73 3.06,3.7 3.45,3.7 ROUTER.1
+5V  (via drill 0.33 pad 0.64, 0.51 pad 0.81)  (4 unrouted)
  Top 0.203: C16.1 24.62,45.43 24.55,45.49 | I2C.1 28.98,26.42 28.97,26.43 31.51,26.43 31.64,26.56 | 21.86,14.24 21.86,14.35 C10.1
  Top 0.254: U$6.7 16.48,36.68 16.15,36.34 14.78,36.34 MEGA32U4.7 | U$6.14 19.04,33.14 18.05,32.15 18.05,31.46 MEGA32U4.14 | U3.7 18.51,12.84 19.19,12.84 19.32,12.97 19.95,12.97 | U$6.2 16.74,39.18 16.4,39.51 16.4,39.64 15.76,40.27 15.26,40.27
  Top 0.305: U$6.34 23.69,40.45 24.65,41.42 24.65,42.81 24.53,42.94 | NTB0104.14 6.09,11.85 5.99,11.95 | 15.26,40.27 14.84,40.27 MEGA32U4.2
  Top 0.406: MEGA32U4.14 18.18,31.52 | 14.75,36.34 MEGA32U4.7 14.7,36.34 13.61,36.34 13.22,35.96 v13.1,35.96 | 14.77,40.4 12.97,40.4 | 12.97,40.4 12.72,40.4 | MEGA32U4.34 24.55,45.49 24.55,47.23 24.27,47.51 | C5.1 12.85,40.52 12.97,40.4 | C10.1 21.61,14.37 21.61,13.35 21.23,12.98 U$2.7 19.95,12.97 | 3.25,15.32 5.24,13.33 C7.1 5.24,12.7 5.99,11.95 | I2C.1 31.38,26.37 31.38,26.43 | 24.15,17.29 24.15,21.52 R7.2 R6.2 | v29.1,35.96 31.64,35.96 | 23.2,47.45 23.26,47.51 | R1.2 10.19,25.15 10.05,25.29 | 14.78,40.4 14.77,40.4 | 14.77,40.4 MEGA32U4.2 | R32.2
  Top 0.508: 21.61,17.8 21.86,17.54 21.86,14.24 | 17.41,27.57 17.66,28.08 C6.1 18.05,29.03 18.05,30.24 18.14,30.33 MEGA32U4.14
  Top 0.61: v11.45,42.05 11.45,42.81 12.59,42.81 12.59,42.93 R32.2 12.46,42.83 12.46,42.18 12.85,41.79 C5.1
  Top 1.016: ROUTER.2 2.05,7.64 2.05,14.11 2.67,14.74 | 2.67,14.74 VOUT_SEL.1 | 2.67,14.74 3.25,15.32 5.1,17.16 10.05,17.16 | 10.05,17.16 10.94,16.27 17.03,16.27 18.56,17.8 21.61,17.8 23.13,17.8 23.64,17.29 24.15,17.29 27.57,17.29 28.34,16.53 31.64,16.53 31.64,26.56 31.64,35.96 31.64,47.39 22.88,47.39 22.88,55.9 20.34,55.9 SENSOR.14 | 10.05,17.16 10.05,25.29 v10.05,27.57 17.41,27.57
  Bottom 0.406: 11.45,43.72 5.47,43.72 J2.4 | JMPA3.3 JMPA2.3 JMPA1.3 | JMPA1.3 JMPA0.3 16.19,44.04 16.15,44.09 JMPA1.3 | JMPD6.3 27.62,36.46 27.62,34.81 JMPD4.3 | v29.1,35.96 28.97,36.08 27.57,36.08
  Bottom 0.61: v10.05,27.57 10.05,31 10.43,31 10.43,35.96 11.45,35.96 | 11.45,35.96 v13.1,35.96 | 11.45,35.96 v11.45,42.05 11.45,43.72
  other vias: 10.56,42.94
  pour Bottom: 10.05,43.7 11.83,43.7 11.83,41.67 10.05,41.67
/RST  (via drill 0.3)  (1 unrouted)
  Top 0.203: v15.51,28.84 16.53,28.84 17.29,29.61 17.29,31.13 | U$6.13 18.54,33.4 17.92,32.91 17.8,32.91 17.29,32.4 | C15.1 14.62,25.54 v13.99,25.54 13.1,25.54 | R1.1 11.95,25.54 13.1,25.54 | T2.1 13.1,23.59 13.1,25.54
  Top 0.254: 17.29,32.4 17.29,31.43 MEGA32U4.13
  Bottom 0.203: v13.99,25.54 13.73,25.8 13.73,27.83 14.75,28.84 v15.51,28.84
A0  (via drill 0.33 pad 0.64)  (2 unrouted)
  Top 0.203: U$6.36 22.04,41.22 22.88,42.05 22.88,42.31
  Top 0.254: 22.88,42.31 23,42.43
  Top 0.305: 12.97,55.77 12.88,55.86 SENSOR.8 13.99,54.6 13.99,51.32 16.15,49.16 17.92,49.16 v18.18,48.91 18.43,48.91 22.88,44.47 22.88,43.04 MEGA32U4.36
  Bottom 0.305: 18.18,45.74 18.3,45.61 18.56,45.61 19.32,46.37 19.32,48.4 18.81,48.91 v18.18,48.91
A1  (via drill 0.33 pad 0.64)  (3 unrouted)
  Top 0.203: U$6.37 21.54,41.6 21.99,42.05 21.99,42.31
  Top 0.254: 21.99,42.31 22.11,42.43 | 17.03,48.53 15.51,48.53 v15,49.04
  Top 0.305: MEGA32U4.37 22.15,44.17 20.08,46.24 19.32,46.24 17.03,48.53 | v15,49.04 12.72,51.2 12.72,53.23
  Bottom 0.254: v15,49.04 15,46.37 15.64,45.74
A2  (via drill 0.33 pad 0.64)  (2 unrouted)
  Top 0.203: 21.02,40.51 21.02,41.93 21.34,42.29
  Top 0.254: 21.34,42.29 MEGA32U4.38
  Top 0.305: SENSOR.6 11.45,54.6 11.45,51.32 13.61,49.16 v13.61,49.04 14.7,47.95 16.65,47.95 18.99,45.61 19.83,45.61 21.35,44.09 21.35,43.32
  Bottom 0.254: v13.61,49.04 13.73,49.04 14.37,48.4 14.37,46.24 14.11,45.99 13.73,45.99
  Bottom 0.406: 13.73,45.99 13.22,45.99 JMPA2.2
A3  (via drill 0.33 pad 0.64)  (1 unrouted)
  Top 0.203: U$6.39 MEGA32U4.39
  Top 0.305: MEGA32U4.39 20.46,43.05 20.46,43.96 19.45,44.97 18.56,44.97 16.27,47.26 11.32,47.26 10.05,48.53 v10.05,48.66 10.05,53.18 SENSOR.5
  Bottom 0.305: v10.05,48.66 10.05,46.24 10.56,45.74 11.19,45.74
AGND  (3 unrouted)
  Top 0.203: 18.54,40.93 17.41,42.05
  Top 0.254: U$6.43 18.54,40.93 | 17.41,42.05 17.41,42.43
  Top 0.406: R11.1 13.12,45.75 13.22,45.86 14.49,45.86 | MEGA32U4.43 17.29,42.98 17.29,43.96 16.15,45.1 14.75,45.1 14.37,45.48 14.37,45.99
AREF  (1 unrouted)
  Top 0.203: 19.04,41.06 18.05,42.05 18.05,42.56
  Top 0.254: U$6.42 19.04,41.06
  Top 0.305: MEGA32U4.42 18.15,44.19 16.53,45.81 16.02,45.81 15.76,45.86
  Top 0.406: C3.2 15.78,45.88 15.76,45.86
AVCC  (via drill 0.51 pad 0.81)
  Top 0.203: U$6.24 24.29,35.18 24.78,34.69 24.78,34.43 25.29,33.92
  Top 0.254: 25.29,33.92 26.29,33.92 MEGA32U4.24 | U$6.44 17.87,40.45 16.53,41.8 16.53,42.96 MEGA32U4.44
  Top 0.406: 13.89,42.97 R32.1 13.87,44.1 | 13.89,42.97 MEGA32U4.44 | 13.87,44.1 13.99,44.21 | 13.87,44.1 13.86,44.1 | v15.13,42.31 15.13,42.94 15.1,42.97 13.89,42.97 | v27.57,31.64 28.46,31.64 28.46,34.05 26.34,34.05 MEGA32U4.24 | 13.87,44.1 C12.1
  Bottom 0.406: v15.13,42.31 15.13,40.02 19.57,35.58 19.57,34.69 22.24,32.02 27.19,32.02 v27.57,31.64
COLD_RESET  (via drill 0.3)  (2 unrouted)
  Top 0.203: v16.27,29.86 16.53,30.11 16.53,31.13 | v13.73,19.7 12.97,20.46 12.33,20.46
  Top 0.254: U$6.12 17.39,33.9 16.65,33.16 16.65,31.49 MEGA32U4.12
  Bottom 0.203: v13.73,19.7 13.22,20.21 13.22,28.08 15,29.86 v16.27,29.86
D4  (via drill 0.33 pad 0.64)  (2 unrouted)
  Top 0.203: U$6.25 24.43,35.68 25.29,34.81 26.3,34.81
  Top 0.254: 26.3,34.81 MEGA32U4.25
  Top 0.305: v29.86,34.05 29.1,34.81 26.56,34.81 26.52,34.78 MEGA32U4.25 | v20.72,51.32 20.34,51.32 19.07,52.59 19.07,53.99 18.43,54.63 16.65,54.63 15.38,55.9
  Bottom 0.305: v20.72,51.32 25.16,46.88 26.94,46.88 29.48,44.34 29.48,39.64 30.12,39 30.12,34.31 v29.86,34.05 28.97,33.04 26.3,33.04 25.67,33.8
D6  (via drill 0.33 pad 0.64)  (1 unrouted)
  Top 0.254: U$6.27 25.2,36.68 25.54,36.34 26.3,36.34 MEGA32U4.27
  Top 0.305: 25.54,36.34 27.83,36.34 29.23,37.48 v29.23,37.73
  Bottom 0.305: 15.26,53.36 16.65,52.09 18.56,52.09 20.46,50.18 20.84,50.18 24.91,46.12 26.69,46.12 28.84,43.96 28.84,39 29.23,38.62 v29.23,37.73 28.72,37.48 26.05,37.48 25.8,37.23 JMPD6.2
D9  (2 unrouted)
  Top 0.305: 7.81,51.02 5.6,53.23 5.19,53.23 SENSOR.1
  Bottom 0.305: J2.5 2.57,41.56 3.83,42.81 3.83,51.96 5.1,53.23
D10
  Top 0.305: R17.2 6.08,50.47 3.83,52.72 3.83,54.58 SENSOR.2
  Bottom 0.305: J2.1 2.81,47.67 2.81,54.5 4.17,55.86 SENSOR.2
GND  (via drill 0.33 pad 0.64, 0.51 pad 0.81)  (2 unrouted)
  Top 0.203: U$2.2 16.36,12.85 | 23.54,42.08 22.55,41.04 | 15.76,37.86 15.95,37.68
  Top 0.254: 16.36,12.85 U3.2 | 23.64,42.05 23.77,42.05 23.74,42.08 23.54,42.08 | 17.86,37.68 17.8,37.73 17.74,37.68 U$6.5 15.95,37.68 | 19.57,34.81 19.57,34.69 19.54,34.65 U$6.15 19.54,32.75 18.94,32.15 MEGA32U4.15 | 22.55,41.04 22.55,39.89
  Top 0.305: U$6.23 22.63,34.68 22.49,34.81 | NTB0104.7 7.87,11.35 NTB0104.EXP | U$2.2 14.63,12.98 14.62,12.97 13.48,12.97 v13.35,13.1
  Top 0.508: J1.S3 4.16,33.92 1.47,33.92 J1.S1 J1.S5 | J1.S6 1.47,28.72 | 1.47,28.72 J1.S2 | J1.S4 4.16,28.72 1.47,28.72
  other vias: 26.56,44.21 22.37,39 23.51,45.23 11.57,34.31 12.84,37.86 8.53,40.78 8.53,39.26 10.05,40.78 8.78,45.23 7.89,46.37 18.56,35.07 18.94,16.02 13.35,14.62 15.76,10.05 16.53,8.91 18.81,10.56 21.86,8.27 22.75,1.41 28.72,10.68 31.89,14.11 23.77,12.59 20.97,21.22 17.03,23.51 22.75,23.13 27.83,29.35 3.45,11.57 1.92,25.29 1.92,22.88 6.62,28.46 6.62,25.92 6.62,23.38 9.03,36.59 1.79,1.92 19.07,29.73 11.7,48.91 13.48,8.4 20.97,19.57
  pour Top (rank 2, no thermals): 0.02,58.56 25.29,58.72 25.42,58.72 25.42,50.18 33.57,50.18 33.57,14.11 33.54,8.81 25.4,8.89 25.42,0.02 0.02,-0.11
  pour Bottom (rank 2, no thermals): 0.02,58.82 0.02,-0.11 25.42,-0.11 25.41,8.68 33.57,8.78 33.57,50.1 25.49,50.1 25.29,58.82
GPIO18
  Top 0.203: NTB0104.5 8.14,10.39 8.14,8.78 8.91,8.02 10.94,8.02 11.45,7.51 12.34,7.51 ROUTER.10
GPIO19  (via drill 0.3)  (1 unrouted)
  Top 0.203: NTB0104.8 9.9,11.85 v10.18,11.83 10.43,12.08 10.43,13.35 10.68,13.1
  Bottom 0.203: ROUTER.6 9.03,5.86 11.45,8.27 11.45,10.05 10.18,11.32 v10.18,11.83
GPIO20  (via drill 0.3)
  Top 0.203: v14.49,17.67 15.26,17.67 15.76,18.43 15.76,19.2 R5.2
  Bottom 0.203: ROUTER.5 10.18,4.58 10.18,6.24 11.95,8.02 11.95,10.56 11.19,11.32 11.19,14.62 12.97,16.65 13.48,16.65 v14.49,17.67
GPIO21
  Top 0.203: ROUTER.8 10.31,7 8.4,7 7.13,8.27 7.13,10.56
  Top 0.305: 7.13,10.56 7.13,10.43 NTB0104.3
GPIO22  (1 unrouted)
  Top 0.203: ROUTER.7 12.72,4.34 12.72,6.24 11.95,7 11.19,7 10.68,7.51 8.65,7.51 7.64,8.52 7.64,10.3
GPIO23
  Top 0.203: ROUTER.9 12.85,2.17 8.4,2.17 7.64,2.94 7.64,7 6.62,8.02 6.62,10.3
  Top 0.305: NTB0104.2 6.62,10.31 6.62,10.3
GPIO24  (via drill 0.33 pad 0.64)
  Top 0.203: U3.6 18.52,12.34 19.7,12.34 19.71,12.33 U$2.6 21.11,12.33 21.35,12.08 21.35,10.43 v21.23,10.3 22.51,10.3 R33.2
  Bottom 0.203: ROUTER.12 16.53,7.01 17.29,7.76 18.69,7.76 v21.23,10.3
LED_CTL  (via drill 0.3)  (1 unrouted)
  Top 0.203: v26.43,15.13 27.7,15.13 28.21,14.62 | U$6.32 24.32,39.18 25.42,40.27 26.24,40.27 | MEGA32U4.32 26.37,40.53 v30.37,40.53
  Top 0.254: 26.24,40.27 MEGA32U4.32
  Bottom 0.203: v30.37,40.53 30.75,40.15 30.75,29.1 29.48,27.83 27.83,27.83 27.07,27.07 27.07,17.92 26.43,17.29 v26.43,15.13
MISO  (via drill 0.3)
  Top 0.203: NTB0104.11 7.62,14.35 v8.65,15.38 | v13.48,30.5 14.75,31.64 MEGA32U4.11 | 17.02,34.68 15.51,33.16
  Top 0.254: U$6.11 17.02,34.68 | 15.51,33.16 14.75,33.16 MEGA32U4.11
  Bottom 0.203: v8.65,15.38 11.95,18.68 11.95,28.59 13.48,30.11 v13.48,30.5
MOSI  (via drill 0.3)  (1 unrouted)
  Top 0.203: NTB0104.12 7.13,12.78 7.13,15.38 v7.38,15.64 | 14.71,33.92 MEGA32U4.10 | 14.49,33.92 13.86,33.92 13.48,33.54 13.48,31.64 12.33,30.5 v12.33,30.11 | U$6.10 16.89,35.18 15.76,34.05
  Top 0.254: 15.76,34.05 14.81,34.05 MEGA32U4.10
  Bottom 0.203: v7.38,15.64 8.14,16.4 8.91,16.4 11.45,18.94 11.45,28.84 12.33,29.73 v12.33,30.11
MS14_RESET  (via drill 0.3)  (1 unrouted)
  Top 0.203: v13.22,17.67 12.72,17.67 12.21,18.18 12.21,19.19
  Bottom 0.203: ROUTER.3 6.37,3.45 7.64,4.71 7.64,6.75 8.14,7.51 9.92,7.51 10.94,8.52 10.94,9.54 9.41,11.06 9.41,12.59 10.68,13.6 10.68,14.88 v13.22,17.67
N$2  (1 unrouted)
  Top 0.406: R8.2 7.62,35.43 7.38,35.2 | YSSR05.2 7.53,35.09 7.27,35.09 6.11,33.92 6.11,32.15 5.6,31.74 4.26,31.74 J1.P2
N$4
  Top 0.203: MEGA32U4.6 13.81,37.17 12.21,36.72 11.83,36.72 | 11.83,36.72 11.7,36.72 | C4.2 11.75,36.64 11.83,36.72
  Top 0.254: U$6.6 MEGA32U4.6
N$8  (1 unrouted)
  Top 0.203: T2.3 15.51,21.74 15.51,20.84 | R5.1 R15.2
N$9  (1 unrouted)
  Top 0.203: T3.2 26.78,13.46 R30.2 28.1,13.46 28.21,13.35
N$10  (1 unrouted)
  Top 0.406: 4.33,31.05 6.77,31.05 R9.2 7.62,33.06 YSSR05.3
PB4
  Top 0.254: U$6.28 MEGA32U4.28
PB5  (via drill 0.33, 0.33 pad 0.64)  (3 unrouted)
  Top 0.254: U$6.29 25.23,37.68 25.54,37.99 26.33,37.99 MEGA32U4.29
  Top 0.305: 26.56,37.99 27.7,37.99 v28.21,38.37 | v6.49,45.61 6.49,45.48 6.37,45.35 4.33,45.35 3.83,44.85 3.83,42.81 5.1,41.55
  Bottom 0.305: v28.21,38.37 25.54,38.37 22.49,41.42 22.49,42.81 21.35,43.96 21.35,47.51 18.18,50.69 8.91,50.69 6.87,48.66 6.87,45.99 v6.49,45.61
PB6  (via drill 0.3, 0.33 pad 0.64)  (2 unrouted)
  Top 0.254: U$6.30 24.84,38.18 25.42,38.75 26.31,38.75 MEGA32U4.30
  Top 0.305: 5.97,48.66 v4.84,48.66 | 26.43,38.88 27.45,38.88 v27.96,39.64
  Bottom 0.305: v4.84,48.66 4.84,46.88 J2.2 5.09,47.88 8.53,51.32 18.43,51.32 21.99,47.77 21.99,44.21 23.13,43.07 23.13,41.93 25.42,39.64 v27.96,39.64
PC6
  Top 0.203: U$6.31 24.58,38.68 25.42,39.51 26.28,39.51
  Top 0.254: 26.28,39.51 MEGA32U4.31
PD5
  Top 0.254: U$6.22 23.28,33.9 24.65,32.53 24.65,31.49 MEGA32U4.22
PD6  (1 unrouted)
  Top 0.254: U$6.26 24.69,36.18 25.16,35.7 25.67,35.7 25.8,35.58
  Top 0.305: 25.8,35.58 26.3,35.58 26.43,35.58
PE2
  Top 0.203: 23.81,39.82 25.16,41.16 26.33,41.16
  Top 0.254: U$6.33 23.81,39.82 | 26.33,41.16 MEGA32U4.33
PE6  (1 unrouted)
  Top 0.254: MEGA32U4.1 15.88,41.18 17.29,39.77
SCK  (via drill 0.3, 0.33 pad 0.64)  (1 unrouted)
  Top 0.203: NTB0104.10 8.12,13.32 v8.65,13.86 | U$6.9 16.75,35.68 15.89,34.81 | MEGA32U4.9 13.95,34.78 12.97,33.8 12.97,32.4 v12.59,32.15
  Top 0.254: 15.89,34.81 14.88,34.81
  Bottom 0.203: v8.65,13.86 10.18,15.38 10.18,15.89 12.72,18.43 12.72,28.34 14.88,30.5 14.88,31.64 14.11,32.15 v12.59,32.15
SCL
  Top 0.254: U$6.18 21.04,32.59 21.35,32.27 21.35,31.39 MEGA32U4.18
  Top 0.305: MEGA32U4.18 21.35,30.11 26.94,24.53 26.94,21.73 | 26.94,21.73 27.19,21.48 28.79,21.48 I2C.3 | R7.1 26.73,21.52 26.94,21.73
  Bottom 0.305: SENSOR.12 18.39,55.86 19.57,57.04 21.86,57.04 23.64,55.26 23.64,50.44 25.42,48.66 27.45,48.66 32.02,44.09 32.02,23.64 29.67,21.29 I2C.3
SDA  (3 unrouted)
  Top 0.203: U$6.19 21.54,33.1 22.11,32.53 22.11,31.4
  Top 0.254: 22.11,31.4 MEGA32U4.19
  Top 0.305: 28.97,23.76 28.72,23.76 22.11,30.37 22.11,31.37 | 22.11,31.37 22.11,31.38 | MEGA32U4.19 22.11,31.37 | R6.1 26.17,19.95 29.99,19.95 30.62,20.46 30.62,22.19 I2C.2
  Bottom 0.305: 29.1,23.76 29.61,23.76 31.26,25.42 31.26,43.58 26.94,47.89 25.16,47.89 22.75,50.31 22.75,53.74 21.86,54.63 19.45,54.63 18.18,53.36 17.8,53.36
SENSOR_LED  (1 unrouted)
  Top 0.203: ROUTER.16 21.61,5.87 22.76,5.87 23.89,7 23.89,9.54 24.4,10.05 26.18,10.05
SS  (via drill 0.3, 0.33 pad 0.64)
  Top 0.203: NTB0104.13 6.62,14.37 v6.37,14.62 | U$6.8 16.62,36.18 16.15,35.7 14.87,35.7 | MEGA32U4.8 13.99,35.58 12.46,34.05 12.46,33.42 11.7,32.66 11.7,30.75 11.06,30.11 v11.06,29.73
  Top 0.254: 14.87,35.7 MEGA32U4.8
  Bottom 0.203: v11.06,29.73 11.06,29.61 10.94,29.48 10.94,19.19 8.65,16.91 7.38,16.91 6.37,15.89 v6.37,14.62
UART_RX
  Top 0.203: U3.5 18.73,11.6 U$2.5 20.07,6.86 ROUTER.14
UART_RXD1  (via drill 0.33 pad 0.64)  (2 unrouted)
  Top 0.203: U$6.20 22.04,33.24 22.88,32.4 22.88,31.44 | U$2.8 18.91,13.7 18.56,13.35 | MEGA32U4.20 22.94,30.31 25.03,28.21 v25.54,28.21 | v20.46,15.76 20.08,15.38 20.08,13.73
  Top 0.254: 22.88,31.44 MEGA32U4.20
  Bottom 0.203: v25.54,28.21 24.15,26.94 24.15,18.3 21.61,15.76 v20.46,15.76
UART_TX
  Top 0.203: U3.4 17.03,11.6 U$2.4 17.8,9.53 17.8,5.22 19.07,3.95 ROUTER.13
UART_TXD1  (via drill 0.33 pad 0.64)  (1 unrouted)
  Top 0.203: U3.1 16.95,13.7 U$2.1 15.72,14.2 v16.4,14.88 | 23.77,31 23.77,30.24 24.53,29.48 v25.67,29.48 | 23.77,31 23.77,31.35 MEGA32U4.21 | 23.77,31 23.89,31.13
  Top 0.254: U$6.21 22.54,33.5 23.64,32.4 23.64,31.48 MEGA32U4.21
  Bottom 0.203: v16.4,14.88 21.48,14.88 24.65,18.05 24.65,26.56 25.16,27.07 25.67,27.07 26.43,27.7 26.43,28.84 25.8,29.35
USB_N  (1 unrouted)
  Top 0.203: U$6.3 16.47,38.68 15.64,39.51 14.8,39.51
  Top 0.305: 14.8,39.51 MEGA32U4.3
  Top 0.406: MEGA32U4.3 12.02,39.57 10.18,37.73 8.91,37.73
USB_P
  Top 0.203: U$6.4 16.21,38.18 15.64,38.75 14.76,38.75
  Top 0.305: 14.76,38.75 MEGA32U4.4
  Top 0.406: MEGA32U4.4 12.36,38.77 10.68,37.1 10.68,31.51 9.67,30.37 9.01,30.37 R9.1
USB_VCC  (via drill 0.6)
  Top 0.406: J1.P1 4.84,32.4 5.35,32.91 5.35,34.94 v4.84,35.45 C1.+ 6.27,39.38 C2.1 | v8.91,31.64 9.46,32.19 YSSR05.4
  Bottom 0.406: v4.84,35.45 5.1,35.45 v8.91,31.64
VCC  (via drill 0.41)  (1 unrouted)
  Top 0.406: v1.75,48.65 1.75,49.37 2.05,49.67
  Bottom 0.406: VOUT_SEL.2 4.13,17.72 4.84,18.43 4.84,25.8 2.99,27.57 2.99,37.99 1.03,40.53 1.03,47.68 v1.75,48.65
VOUT  (1 unrouted)
  Top 0.406: D2.1 2,55.98 3.32,57.29 6.11,57.29 7.64,55.77
XTAL1  (3 unrouted)
  Top 0.203: 19.19,27.7 18.56,27.07 18.56,25.04 19.57,24.27 19.6,24.29 X1.3 19.69,24.25 19.69,22.95 C14.2 | 20.84,27.83 20.84,28.84 19.95,29.86 19.95,30.37 19.7,30.62 19.7,31 | R16.2 20.69,27.7 19.19,27.7
  Top 0.254: U$6.16 20.04,32.48 19.7,32.15 19.7,31.41 MEGA32U4.16
XTAL2
  Top 0.203: C9.2 22.11,26.07 X1.1 22.11,26.22 22.11,27.83 | MEGA32U4.17 20.55,30.15 22.11,28.59 22.11,27.83 | 22.11,27.83 R16.1
  Top 0.254: U$6.17 MEGA32U4.17

### Text on the board
tDocu: 5V | SDA | SCL | 3.3v | GND | Model: M32 V1.0 | VOUT | 5v | Internet of Things Module
bDocu: down | 5v_up | down | up | D6 | D6 | D4 | D4
214bmp: D:/SmartProjects/Snc/a4_bn_logo2.bmp